# Altium schematic sheet ESP32.SchDoc
size A4
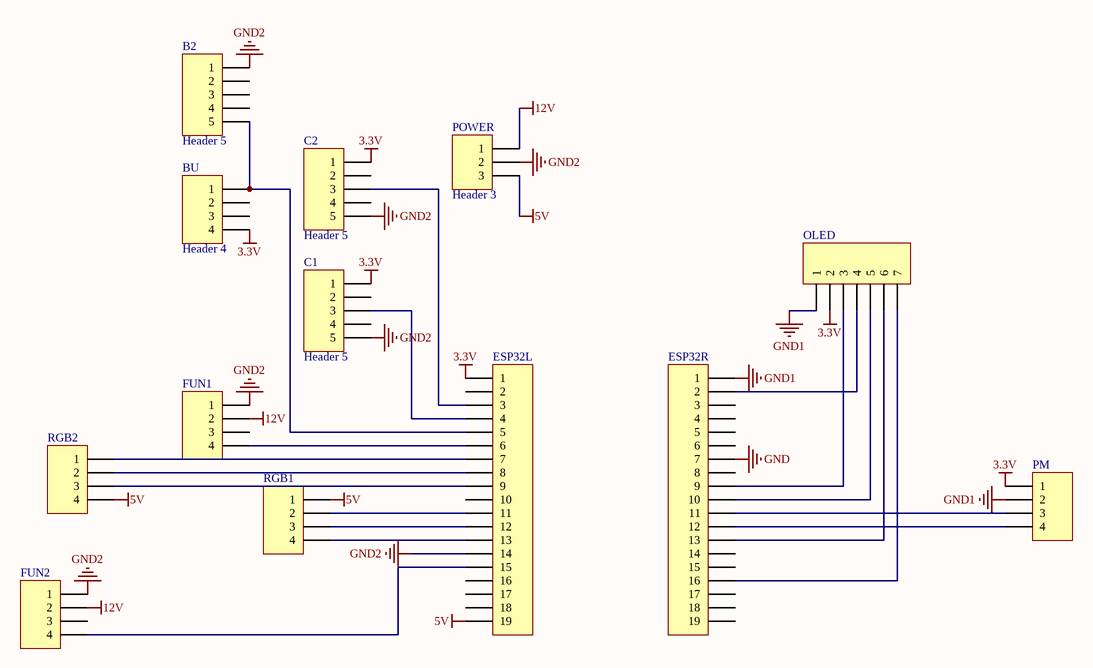
[diagram p0: ESP32.SchDoc]

## Parts
B2  Header 5  [HDR1X5]
BU  Header 4  [HDR1X4]
C1  Header 5  [HDR1X5]
C2  Header 5  [HDR1X5]
ESP32L  Header 19  [HDR1X19]  (value not drawn)
ESP32R  Header 19  [HDR1X19]  (value not drawn)
FUN1  Header 4  [HDR1X4]  (value not drawn)
FUN2  Header 4  [HDR1X4]  (value not drawn)
OLED  Header 7  [HDR1X7]  (value not drawn)
PM  Header 4  [HDR1X4]  (value not drawn)
POWER  Header 3  [HDR1X3]
RGB1  Header 4  [HDR1X4]  (value not drawn)
RGB2  Header 4  [HDR1X4]  (value not drawn)

## Nets
3.3V: BU.4 C1.1 C2.1 ESP32L.1 OLED.2 PM.1
5V: ESP32L.19 POWER.3 RGB1.1 RGB2.4
12V: FUN1.2 FUN2.2 POWER.1
GND: ESP32R.7
GND1: ESP32R.1 OLED.1 PM.2
GND2: B2.1 C1.5 C2.5 ESP32L.14 FUN1.1 FUN2.1 POWER.2
NetB2_5: B2.5 BU.1 ESP32L.5
NetC1_3: C1.3 ESP32L.4
NetC2_3: C2.3 ESP32L.3
NetESP32L_6: ESP32L.6 FUN1.4
NetESP32L_7: ESP32L.7 RGB2.1
NetESP32L_8: ESP32L.8 RGB2.2
NetESP32L_9: ESP32L.9 RGB2.3
NetESP32L_11: ESP32L.11 RGB1.2
NetESP32L_12: ESP32L.12 RGB1.3
NetESP32L_13: ESP32L.13 RGB1.4
NetESP32L_15: ESP32L.15 FUN2.4
NetESP32R_2: ESP32R.2 OLED.4
NetESP32R_9: ESP32R.9 OLED.3
NetESP32R_10: ESP32R.10 OLED.5
NetESP32R_11: ESP32R.11 PM.3
NetESP32R_12: ESP32R.12 PM.4
NetESP32R_13: ESP32R.13 OLED.6
NetESP32R_16: ESP32R.16 OLED.7

Not connected (* = marked no-connect by the designer): B2 2 3 4; BU 2 3; C1 2 4; C2 2 4; ESP32L 2 10 16 17 18; ESP32R 3 4 5 6 8 14 15 17 18 19; FUN1 3; FUN2 3

## Library data of the parts
B2 C1 C2 = Header 5: Header, 5-Pin; LatestRevisionDate: 17-Jul-2002; LatestRevisionNote: Re-released for DXP Platform.; Publisher: Altium Limited
BU FUN1 FUN2 PM RGB1 RGB2 = Header 4: Header, 4-Pin; LatestRevisionDate: 17-Jul-2002; LatestRevisionNote: Re-released for DXP Platform.; Publisher: Altium Limited
ESP32L ESP32R = Header 19: Header, 19-Pin; LatestRevisionDate: 17-Jul-2002; LatestRevisionNote: Re-released for DXP Platform.; Publisher: Altium Limited
OLED = Header 7: Header, 7-Pin; LatestRevisionDate: 17-Jul-2002; LatestRevisionNote: Re-released for DXP Platform.; Publisher: Altium Limited
POWER = Header 3: Header, 3-Pin; LatestRevisionDate: 17-Jul-2002; LatestRevisionNote: Re-released for DXP Platform.; Publisher: Altium Limited